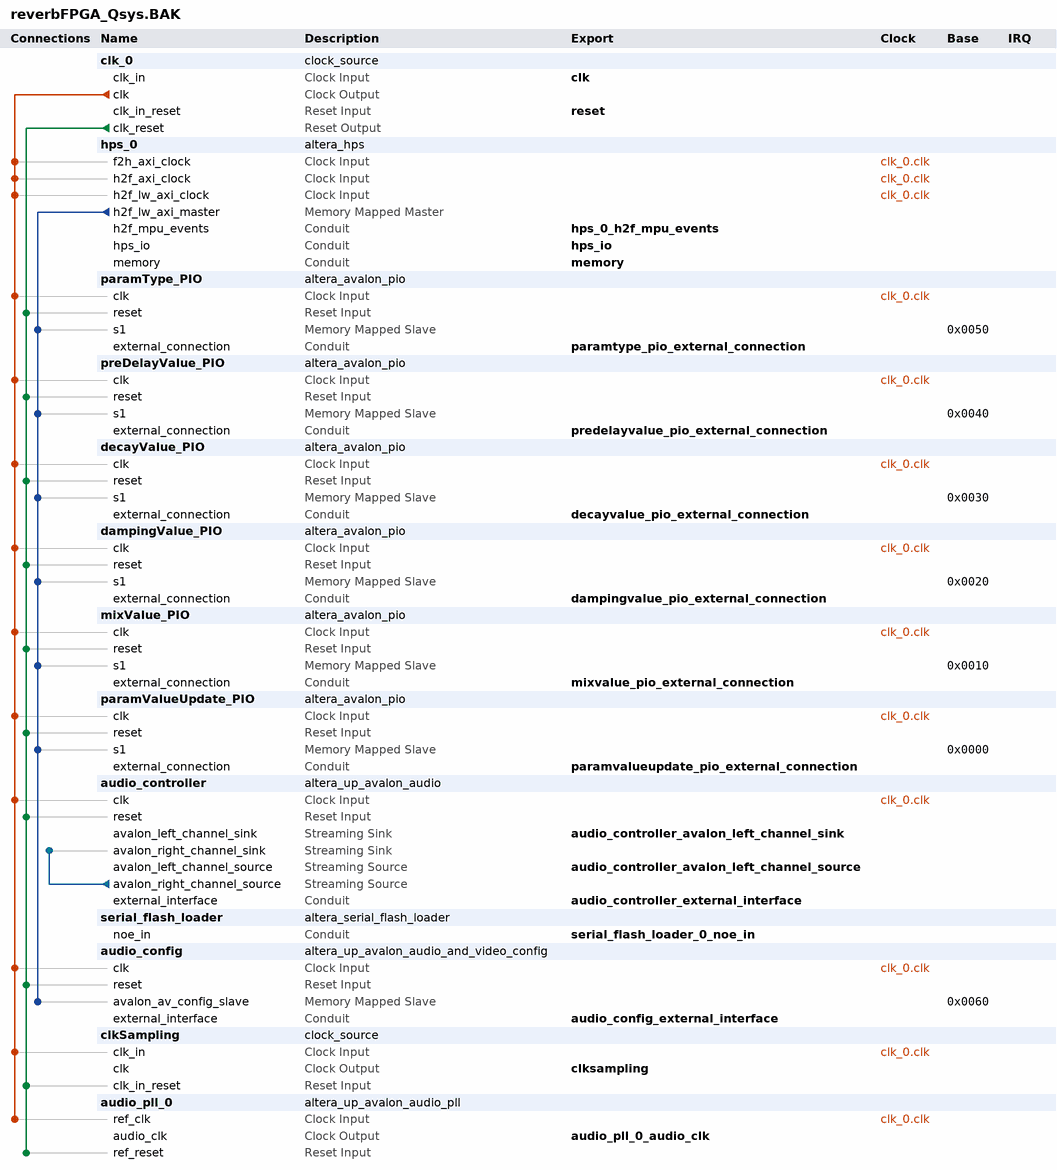
[diagram p0: system contents]
# Platform Designer (Qsys) system reverbFPGA_Qsys.BAK, Cyclone V 5CSEMA5F31C6
# Parameters at their usual value, and those the tool derives, are not listed.
package require -exact qsys 18.0
create_system reverbFPGA_Qsys.BAK
set_project_property DEVICE_FAMILY {Cyclone V}
set_project_property DEVICE 5CSEMA5F31C6

add_instance clk_0 clock_source 18.0
set_instance_parameter_value clk_0 clockFrequency 50000000

add_instance hps_0 altera_hps 18.0
set_instance_parameter_value hps_0 EMAC1_Mode N/A
set_instance_parameter_value hps_0 EMAC1_PinMuxing Unused
set_instance_parameter_value hps_0 F2SCLK_COLDRST_Enable false
set_instance_parameter_value hps_0 F2SCLK_DBGRST_Enable false
set_instance_parameter_value hps_0 F2SCLK_WARMRST_Enable false
set_instance_parameter_value hps_0 F2SINTERRUPT_Enable false
set_instance_parameter_value hps_0 F2S_Width 1
set_instance_parameter_value hps_0 FPGA_PERIPHERAL_OUTPUT_CLOCK_FREQ_EMAC0_GTX_CLK 125
set_instance_parameter_value hps_0 FPGA_PERIPHERAL_OUTPUT_CLOCK_FREQ_EMAC0_MD_CLK 2.5
set_instance_parameter_value hps_0 FPGA_PERIPHERAL_OUTPUT_CLOCK_FREQ_EMAC1_GTX_CLK 125
set_instance_parameter_value hps_0 FPGA_PERIPHERAL_OUTPUT_CLOCK_FREQ_EMAC1_MD_CLK 2.5
set_instance_parameter_value hps_0 HPS_PROTOCOL DDR3
set_instance_parameter_value hps_0 I2C0_Mode I2C
set_instance_parameter_value hps_0 I2C0_PinMuxing {HPS I/O Set 0}
set_instance_parameter_value hps_0 I2C1_Mode N/A
set_instance_parameter_value hps_0 I2C1_PinMuxing Unused
set_instance_parameter_value hps_0 LWH2F_Enable true
set_instance_parameter_value hps_0 MEM_BANKADDR_WIDTH 3
set_instance_parameter_value hps_0 MEM_CLK_FREQ 300.0
set_instance_parameter_value hps_0 MEM_CLK_FREQ_MAX 400.0
set_instance_parameter_value hps_0 MEM_COL_ADDR_WIDTH 8
set_instance_parameter_value hps_0 MEM_DQ_WIDTH 8
set_instance_parameter_value hps_0 MEM_DRV_STR RZQ/6
set_instance_parameter_value hps_0 MEM_IF_DM_PINS_EN false
set_instance_parameter_value hps_0 MEM_ROW_ADDR_WIDTH 12
set_instance_parameter_value hps_0 MEM_RTT_NOM RZQ/4
set_instance_parameter_value hps_0 MEM_RTT_WR {Dynamic ODT off}
set_instance_parameter_value hps_0 MEM_TCL 7
set_instance_parameter_value hps_0 MEM_TFAW_NS 37.5
set_instance_parameter_value hps_0 MEM_TINIT_US 499
set_instance_parameter_value hps_0 MEM_TMRD_CK 3
set_instance_parameter_value hps_0 MEM_TRAS_NS 40.0
set_instance_parameter_value hps_0 MEM_TRCD_NS 15.0
set_instance_parameter_value hps_0 MEM_TREFI_US 7.0
set_instance_parameter_value hps_0 MEM_TRFC_NS 75.0
set_instance_parameter_value hps_0 MEM_TRP_NS 15.0
set_instance_parameter_value hps_0 MEM_TWTR 2
set_instance_parameter_value hps_0 MEM_VENDOR JEDEC
set_instance_parameter_value hps_0 MEM_WTCL 6
set_instance_parameter_value hps_0 MPU_EVENTS_Enable true
set_instance_parameter_value hps_0 QSPI_Mode N/A
set_instance_parameter_value hps_0 QSPI_PinMuxing Unused
set_instance_parameter_value hps_0 REF_CLK_FREQ 125.0
set_instance_parameter_value hps_0 S2FCLK_USER2CLK 5
set_instance_parameter_value hps_0 S2F_Width 1
set_instance_parameter_value hps_0 SDIO_Mode N/A
set_instance_parameter_value hps_0 SDIO_PinMuxing Unused
set_instance_parameter_value hps_0 SPIM1_Mode N/A
set_instance_parameter_value hps_0 SPIM1_PinMuxing Unused
set_instance_parameter_value hps_0 STM_Enable false
set_instance_parameter_value hps_0 TIMING_BOARD_AC_SKEW 0.02
set_instance_parameter_value hps_0 TIMING_BOARD_AC_TO_CK_SKEW 0.0
set_instance_parameter_value hps_0 TIMING_BOARD_DQ_TO_DQS_SKEW 0.0
set_instance_parameter_value hps_0 TIMING_BOARD_MAX_CK_DELAY 0.6
set_instance_parameter_value hps_0 TIMING_BOARD_MAX_DQS_DELAY 0.6
set_instance_parameter_value hps_0 TIMING_BOARD_SKEW_BETWEEN_DQS 0.02
set_instance_parameter_value hps_0 TIMING_BOARD_SKEW_CKDQS_DIMM_MAX 0.01
set_instance_parameter_value hps_0 TIMING_BOARD_SKEW_CKDQS_DIMM_MIN -0.01
set_instance_parameter_value hps_0 TIMING_BOARD_SKEW_WITHIN_DQS 0.02
set_instance_parameter_value hps_0 TIMING_TDH 125
set_instance_parameter_value hps_0 TIMING_TDQSCK 400
set_instance_parameter_value hps_0 TIMING_TDQSQ 120
set_instance_parameter_value hps_0 TIMING_TDS 50
set_instance_parameter_value hps_0 TIMING_TIH 250
set_instance_parameter_value hps_0 TIMING_TIS 175
set_instance_parameter_value hps_0 TIMING_TQSH 0.38
set_instance_parameter_value hps_0 UART0_Mode {No Flow Control}
set_instance_parameter_value hps_0 UART0_PinMuxing {HPS I/O Set 0}
set_instance_parameter_value hps_0 USB1_Mode N/A
set_instance_parameter_value hps_0 USB1_PinMuxing Unused
set_instance_parameter_value hps_0 desired_cfg_clk_mhz 100.0
set_instance_parameter_value hps_0 desired_qspi_clk_mhz 400.0

add_instance paramType_PIO altera_avalon_pio 18.0
set_instance_parameter_value paramType_PIO direction Input
set_instance_parameter_value paramType_PIO width 4

add_instance preDelayValue_PIO altera_avalon_pio 18.0
set_instance_parameter_value preDelayValue_PIO direction Output
set_instance_parameter_value preDelayValue_PIO width 24

add_instance decayValue_PIO altera_avalon_pio 18.0
set_instance_parameter_value decayValue_PIO direction Output
set_instance_parameter_value decayValue_PIO width 24

add_instance dampingValue_PIO altera_avalon_pio 18.0
set_instance_parameter_value dampingValue_PIO direction Output
set_instance_parameter_value dampingValue_PIO width 24

add_instance mixValue_PIO altera_avalon_pio 18.0
set_instance_parameter_value mixValue_PIO direction Output
set_instance_parameter_value mixValue_PIO width 24

add_instance paramValueUpdate_PIO altera_avalon_pio 18.0
set_instance_parameter_value paramValueUpdate_PIO direction Input
set_instance_parameter_value paramValueUpdate_PIO width 2

add_instance audio_controller altera_up_avalon_audio 18.0
set_instance_parameter_value audio_controller audio_in true
set_instance_parameter_value audio_controller avalon_bus_type Streaming
set_instance_parameter_value audio_controller dw 24

add_instance serial_flash_loader altera_serial_flash_loader 18.0
set_instance_parameter_value serial_flash_loader ENHANCED_MODE true
set_instance_parameter_value serial_flash_loader gui_shared_access false

add_instance audio_config altera_up_avalon_audio_and_video_config 18.0
set_instance_parameter_value audio_config audio_in {Line In to ADC}
set_instance_parameter_value audio_config bit_length 24
set_instance_parameter_value audio_config board DE1-SoC
set_instance_parameter_value audio_config line_in_bypass false
set_instance_parameter_value audio_config sampling_rate {48 kHz}

add_instance clkSampling clock_source 18.0
set_instance_parameter_value clkSampling clockFrequency 48000
set_instance_parameter_value clkSampling clockFrequencyKnown false

add_instance audio_pll_0 altera_up_avalon_audio_pll 18.0
set_instance_parameter_value audio_pll_0 audio_clk_freq 16.9344
set_instance_parameter_value audio_pll_0 gui_refclk 50.0

# connections
add_connection clk_0.clk audio_config.clk clock
add_connection clk_0.clk audio_controller.clk clock
add_connection clk_0.clk audio_pll_0.ref_clk clock
add_connection clk_0.clk clkSampling.clk_in clock
add_connection clk_0.clk dampingValue_PIO.clk clock
add_connection clk_0.clk decayValue_PIO.clk clock
add_connection clk_0.clk hps_0.f2h_axi_clock clock
add_connection clk_0.clk hps_0.h2f_axi_clock clock
add_connection clk_0.clk hps_0.h2f_lw_axi_clock clock
add_connection clk_0.clk mixValue_PIO.clk clock
add_connection clk_0.clk paramType_PIO.clk clock
add_connection clk_0.clk paramValueUpdate_PIO.clk clock
add_connection clk_0.clk preDelayValue_PIO.clk clock
add_connection clk_0.clk_reset audio_config.reset reset
add_connection clk_0.clk_reset audio_controller.reset reset
add_connection clk_0.clk_reset audio_pll_0.ref_reset reset
add_connection clk_0.clk_reset clkSampling.clk_in_reset reset
add_connection clk_0.clk_reset dampingValue_PIO.reset reset
add_connection clk_0.clk_reset decayValue_PIO.reset reset
add_connection clk_0.clk_reset mixValue_PIO.reset reset
add_connection clk_0.clk_reset paramType_PIO.reset reset
add_connection clk_0.clk_reset paramValueUpdate_PIO.reset reset
add_connection clk_0.clk_reset preDelayValue_PIO.reset reset
add_connection hps_0.h2f_lw_axi_master audio_config.avalon_av_config_slave avalon
set_connection_parameter_value hps_0.h2f_lw_axi_master/audio_config.avalon_av_config_slave baseAddress 0x0060
add_connection hps_0.h2f_lw_axi_master dampingValue_PIO.s1 avalon
set_connection_parameter_value hps_0.h2f_lw_axi_master/dampingValue_PIO.s1 baseAddress 0x0020
add_connection hps_0.h2f_lw_axi_master decayValue_PIO.s1 avalon
set_connection_parameter_value hps_0.h2f_lw_axi_master/decayValue_PIO.s1 baseAddress 0x0030
add_connection hps_0.h2f_lw_axi_master mixValue_PIO.s1 avalon
set_connection_parameter_value hps_0.h2f_lw_axi_master/mixValue_PIO.s1 baseAddress 0x0010
add_connection hps_0.h2f_lw_axi_master paramType_PIO.s1 avalon
set_connection_parameter_value hps_0.h2f_lw_axi_master/paramType_PIO.s1 baseAddress 0x0050
add_connection hps_0.h2f_lw_axi_master paramValueUpdate_PIO.s1 avalon
set_connection_parameter_value hps_0.h2f_lw_axi_master/paramValueUpdate_PIO.s1 baseAddress 0x0000
add_connection hps_0.h2f_lw_axi_master preDelayValue_PIO.s1 avalon
set_connection_parameter_value hps_0.h2f_lw_axi_master/preDelayValue_PIO.s1 baseAddress 0x0040
add_connection audio_controller.avalon_right_channel_source audio_controller.avalon_right_channel_sink avalon_streaming

# exported interfaces
add_interface audio_config_external_interface conduit end
set_interface_property audio_config_external_interface EXPORT_OF audio_config.external_interface
add_interface audio_controller_avalon_left_channel_sink avalon_streaming sink
set_interface_property audio_controller_avalon_left_channel_sink EXPORT_OF audio_controller.avalon_left_channel_sink
add_interface audio_controller_avalon_left_channel_source avalon_streaming source
set_interface_property audio_controller_avalon_left_channel_source EXPORT_OF audio_controller.avalon_left_channel_source
add_interface audio_controller_external_interface conduit end
set_interface_property audio_controller_external_interface EXPORT_OF audio_controller.external_interface
add_interface audio_pll_0_audio_clk clock source
set_interface_property audio_pll_0_audio_clk EXPORT_OF audio_pll_0.audio_clk
add_interface clk clock sink
set_interface_property clk EXPORT_OF clk_0.clk_in
add_interface clksampling clock source
set_interface_property clksampling EXPORT_OF clkSampling.clk
add_interface dampingvalue_pio_external_connection conduit end
set_interface_property dampingvalue_pio_external_connection EXPORT_OF dampingValue_PIO.external_connection
add_interface decayvalue_pio_external_connection conduit end
set_interface_property decayvalue_pio_external_connection EXPORT_OF decayValue_PIO.external_connection
add_interface hps_0_h2f_mpu_events conduit end
set_interface_property hps_0_h2f_mpu_events EXPORT_OF hps_0.h2f_mpu_events
add_interface hps_io conduit end
set_interface_property hps_io EXPORT_OF hps_0.hps_io
add_interface memory conduit end
set_interface_property memory EXPORT_OF hps_0.memory
add_interface mixvalue_pio_external_connection conduit end
set_interface_property mixvalue_pio_external_connection EXPORT_OF mixValue_PIO.external_connection
add_interface paramtype_pio_external_connection conduit end
set_interface_property paramtype_pio_external_connection EXPORT_OF paramType_PIO.external_connection
add_interface paramvalueupdate_pio_external_connection conduit end
set_interface_property paramvalueupdate_pio_external_connection EXPORT_OF paramValueUpdate_PIO.external_connection
add_interface predelayvalue_pio_external_connection conduit end
set_interface_property predelayvalue_pio_external_connection EXPORT_OF preDelayValue_PIO.external_connection
add_interface reset reset sink
set_interface_property reset EXPORT_OF clk_0.clk_in_reset
add_interface serial_flash_loader_0_noe_in conduit end
set_interface_property serial_flash_loader_0_noe_in EXPORT_OF serial_flash_loader.noe_in

set_interconnect_requirement {$system} qsys_mm.clockCrossingAdapter HANDSHAKE
set_interconnect_requirement {$system} qsys_mm.enableEccProtection FALSE
set_interconnect_requirement {$system} qsys_mm.insertDefaultSlave FALSE
set_interconnect_requirement {$system} qsys_mm.maxAdditionalLatency 1

save_system reverbFPGA_Qsys.BAK.qsys
